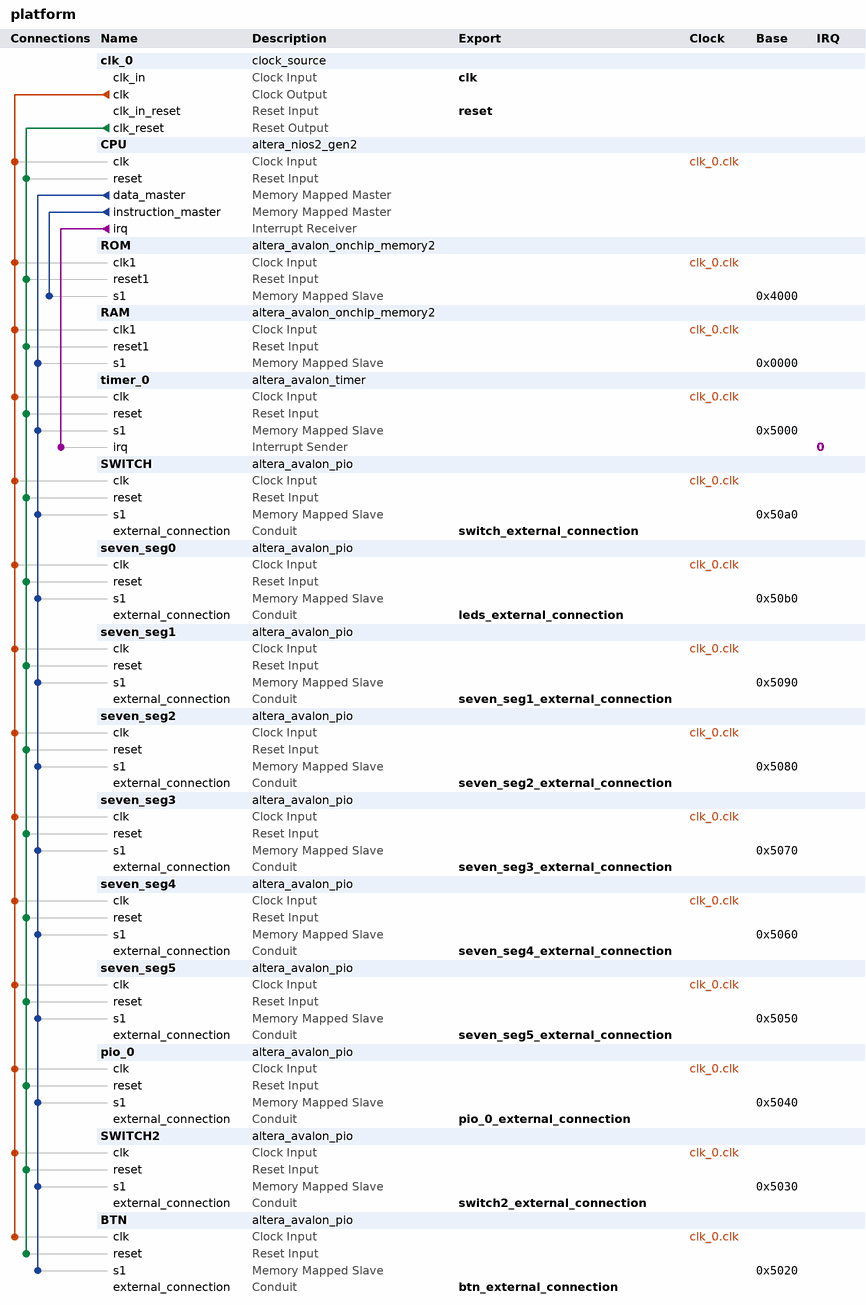
[diagram p0: system contents]
# Platform Designer (Qsys) system platform, Cyclone V 5CSEMA5F31C6
# Parameters at their usual value, and those the tool derives, are not listed.
package require -exact qsys 17.1
create_system platform
set_project_property DEVICE_FAMILY {Cyclone V}
set_project_property DEVICE 5CSEMA5F31C6

add_instance clk_0 clock_source 17.1
set_instance_parameter_value clk_0 clockFrequency 50000000

add_instance CPU altera_nios2_gen2 17.1
set_instance_parameter_value CPU dcache_size 2048
set_instance_parameter_value CPU debug_enabled false
set_instance_parameter_value CPU exceptionSlave ROM.s1
set_instance_parameter_value CPU icache_size 4096
set_instance_parameter_value CPU impl Tiny
set_instance_parameter_value CPU resetSlave ROM.s1

add_instance ROM altera_avalon_onchip_memory2 17.1
set_instance_parameter_value ROM dataWidth 32
set_instance_parameter_value ROM dualPort false
set_instance_parameter_value ROM initMemContent true
set_instance_parameter_value ROM initializationFileName onchip_mem.hex
set_instance_parameter_value ROM memorySize 4096
set_instance_parameter_value ROM writable false

add_instance RAM altera_avalon_onchip_memory2 17.1
set_instance_parameter_value RAM dataWidth 32
set_instance_parameter_value RAM dualPort false
set_instance_parameter_value RAM initMemContent true
set_instance_parameter_value RAM initializationFileName onchip_mem.hex
set_instance_parameter_value RAM memorySize 16384

add_instance timer_0 altera_avalon_timer 17.1
set_instance_parameter_value timer_0 alwaysRun true
set_instance_parameter_value timer_0 fixedPeriod true
set_instance_parameter_value timer_0 period 10
set_instance_parameter_value timer_0 periodUnits MSEC
set_instance_parameter_value timer_0 snapshot false

add_instance SWITCH altera_avalon_pio 17.1
set_instance_parameter_value SWITCH direction Input
set_instance_parameter_value SWITCH width 1

add_instance seven_seg0 altera_avalon_pio 17.1
set_instance_parameter_value seven_seg0 direction Output
set_instance_parameter_value seven_seg0 width 7

add_instance seven_seg1 altera_avalon_pio 17.1
set_instance_parameter_value seven_seg1 direction Output
set_instance_parameter_value seven_seg1 width 7

add_instance seven_seg2 altera_avalon_pio 17.1
set_instance_parameter_value seven_seg2 direction Output
set_instance_parameter_value seven_seg2 width 7

add_instance seven_seg3 altera_avalon_pio 17.1
set_instance_parameter_value seven_seg3 direction Output
set_instance_parameter_value seven_seg3 width 7

add_instance seven_seg4 altera_avalon_pio 17.1
set_instance_parameter_value seven_seg4 direction Output
set_instance_parameter_value seven_seg4 width 7

add_instance seven_seg5 altera_avalon_pio 17.1
set_instance_parameter_value seven_seg5 direction Output
set_instance_parameter_value seven_seg5 width 7

add_instance pio_0 altera_avalon_pio 17.1
set_instance_parameter_value pio_0 direction Output
set_instance_parameter_value pio_0 width 3

add_instance SWITCH2 altera_avalon_pio 17.1
set_instance_parameter_value SWITCH2 direction Input
set_instance_parameter_value SWITCH2 width 1

add_instance BTN altera_avalon_pio 17.1
set_instance_parameter_value BTN direction Input
set_instance_parameter_value BTN width 1

# connections
add_connection clk_0.clk BTN.clk clock
add_connection clk_0.clk CPU.clk clock
add_connection clk_0.clk pio_0.clk clock
add_connection clk_0.clk RAM.clk1 clock
add_connection clk_0.clk ROM.clk1 clock
add_connection clk_0.clk seven_seg0.clk clock
add_connection clk_0.clk seven_seg1.clk clock
add_connection clk_0.clk seven_seg2.clk clock
add_connection clk_0.clk seven_seg3.clk clock
add_connection clk_0.clk seven_seg4.clk clock
add_connection clk_0.clk seven_seg5.clk clock
add_connection clk_0.clk SWITCH2.clk clock
add_connection clk_0.clk SWITCH.clk clock
add_connection clk_0.clk timer_0.clk clock
add_connection clk_0.clk_reset BTN.reset reset
add_connection clk_0.clk_reset CPU.reset reset
add_connection clk_0.clk_reset pio_0.reset reset
add_connection clk_0.clk_reset RAM.reset1 reset
add_connection clk_0.clk_reset ROM.reset1 reset
add_connection clk_0.clk_reset seven_seg0.reset reset
add_connection clk_0.clk_reset seven_seg1.reset reset
add_connection clk_0.clk_reset seven_seg2.reset reset
add_connection clk_0.clk_reset seven_seg3.reset reset
add_connection clk_0.clk_reset seven_seg4.reset reset
add_connection clk_0.clk_reset seven_seg5.reset reset
add_connection clk_0.clk_reset SWITCH2.reset reset
add_connection clk_0.clk_reset SWITCH.reset reset
add_connection clk_0.clk_reset timer_0.reset reset
add_connection CPU.data_master BTN.s1 avalon
set_connection_parameter_value CPU.data_master/BTN.s1 baseAddress 0x5020
add_connection CPU.data_master pio_0.s1 avalon
set_connection_parameter_value CPU.data_master/pio_0.s1 baseAddress 0x5040
add_connection CPU.data_master RAM.s1 avalon
set_connection_parameter_value CPU.data_master/RAM.s1 baseAddress 0x0000
add_connection CPU.data_master seven_seg0.s1 avalon
set_connection_parameter_value CPU.data_master/seven_seg0.s1 baseAddress 0x50b0
add_connection CPU.data_master seven_seg1.s1 avalon
set_connection_parameter_value CPU.data_master/seven_seg1.s1 baseAddress 0x5090
add_connection CPU.data_master seven_seg2.s1 avalon
set_connection_parameter_value CPU.data_master/seven_seg2.s1 baseAddress 0x5080
add_connection CPU.data_master seven_seg3.s1 avalon
set_connection_parameter_value CPU.data_master/seven_seg3.s1 baseAddress 0x5070
add_connection CPU.data_master seven_seg4.s1 avalon
set_connection_parameter_value CPU.data_master/seven_seg4.s1 baseAddress 0x5060
add_connection CPU.data_master seven_seg5.s1 avalon
set_connection_parameter_value CPU.data_master/seven_seg5.s1 baseAddress 0x5050
add_connection CPU.data_master SWITCH2.s1 avalon
set_connection_parameter_value CPU.data_master/SWITCH2.s1 baseAddress 0x5030
add_connection CPU.data_master SWITCH.s1 avalon
set_connection_parameter_value CPU.data_master/SWITCH.s1 baseAddress 0x50a0
add_connection CPU.data_master timer_0.s1 avalon
set_connection_parameter_value CPU.data_master/timer_0.s1 baseAddress 0x5000
add_connection CPU.instruction_master ROM.s1 avalon
set_connection_parameter_value CPU.instruction_master/ROM.s1 baseAddress 0x4000
add_connection CPU.irq timer_0.irq interrupt
set_connection_parameter_value CPU.irq/timer_0.irq irqNumber 0

# exported interfaces
add_interface btn_external_connection conduit end
set_interface_property btn_external_connection EXPORT_OF BTN.external_connection
add_interface clk clock sink
set_interface_property clk EXPORT_OF clk_0.clk_in
add_interface leds_external_connection conduit end
set_interface_property leds_external_connection EXPORT_OF seven_seg0.external_connection
add_interface pio_0_external_connection conduit end
set_interface_property pio_0_external_connection EXPORT_OF pio_0.external_connection
add_interface reset reset sink
set_interface_property reset EXPORT_OF clk_0.clk_in_reset
add_interface seven_seg1_external_connection conduit end
set_interface_property seven_seg1_external_connection EXPORT_OF seven_seg1.external_connection
add_interface seven_seg2_external_connection conduit end
set_interface_property seven_seg2_external_connection EXPORT_OF seven_seg2.external_connection
add_interface seven_seg3_external_connection conduit end
set_interface_property seven_seg3_external_connection EXPORT_OF seven_seg3.external_connection
add_interface seven_seg4_external_connection conduit end
set_interface_property seven_seg4_external_connection EXPORT_OF seven_seg4.external_connection
add_interface seven_seg5_external_connection conduit end
set_interface_property seven_seg5_external_connection EXPORT_OF seven_seg5.external_connection
add_interface switch2_external_connection conduit end
set_interface_property switch2_external_connection EXPORT_OF SWITCH2.external_connection
add_interface switch_external_connection conduit end
set_interface_property switch_external_connection EXPORT_OF SWITCH.external_connection

set_interconnect_requirement {$system} qsys_mm.clockCrossingAdapter HANDSHAKE
set_interconnect_requirement {$system} qsys_mm.enableEccProtection FALSE
set_interconnect_requirement {$system} qsys_mm.insertDefaultSlave FALSE
set_interconnect_requirement {$system} qsys_mm.maxAdditionalLatency 1

save_system platform.qsys
